# Altium schematic sheet input_module.SchDoc
size A4
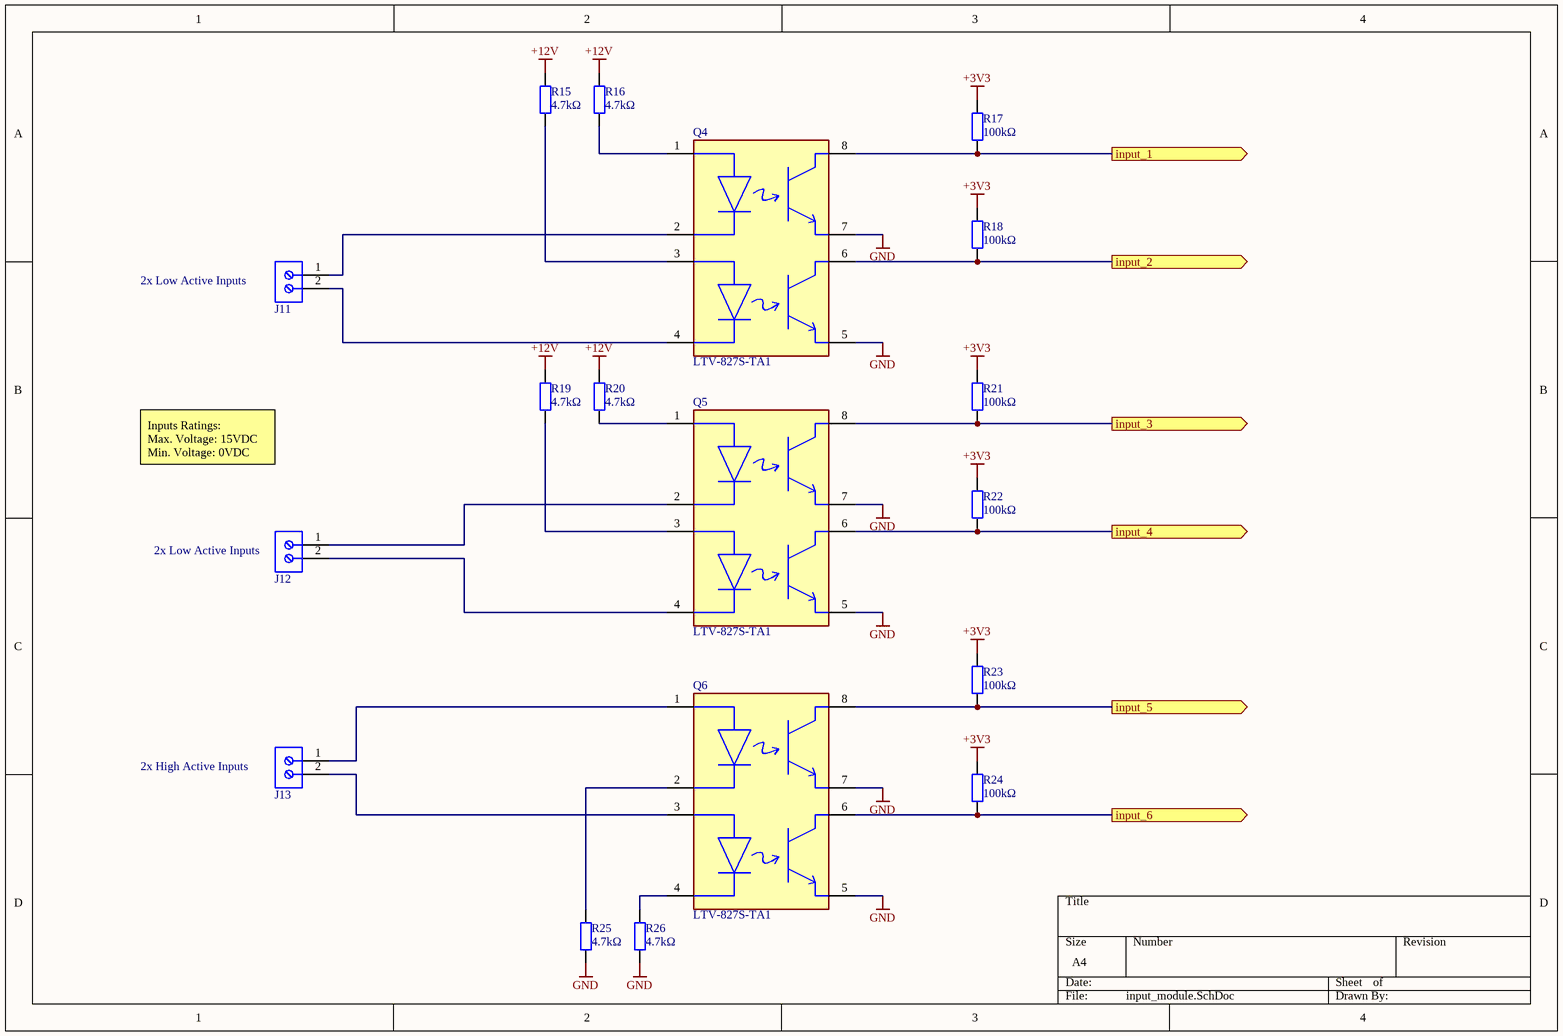
[diagram p0: input_module.SchDoc]

## Parts
J11  282836-2  [TECO-282836-2_V]  (value not drawn)
J12  282836-2  [TECO-282836-2_V]  (value not drawn)
J13  282836-2  [TECO-282836-2_V]  (value not drawn)
Q4  LTV-827S-TA1  [FP-LTV-827S-TA1-MFG]
Q5  LTV-827S-TA1  [FP-LTV-827S-TA1-MFG]
Q6  LTV-827S-TA1  [FP-LTV-827S-TA1-MFG]
R15  4.7kΩ  [RESC2013X50X30ML20T20]
R16  4.7kΩ  [RESC2013X50X30ML20T20]
R17  100kΩ  [RESC2013X50X30ML20T20]
R18  100kΩ  [RESC2013X50X30ML20T20]
R19  4.7kΩ  [RESC2013X50X30ML20T20]
R20  4.7kΩ  [RESC2013X50X30ML20T20]
R21  100kΩ  [RESC2013X50X30ML20T20]
R22  100kΩ  [RESC2013X50X30ML20T20]
R23  100kΩ  [RESC2013X50X30ML20T20]
R24  100kΩ  [RESC2013X50X30ML20T20]
R25  4.7kΩ  [RESC2013X50X30ML20T20]
R26  4.7kΩ  [RESC2013X50X30ML20T20]

## Ports
input_1 (out), input_2 (out), input_3 (out), input_4 (out), input_5 (out), input_6 (out)

## Nets
+3V3: R17.1 R18.1 R21.1 R22.1 R23.1 R24.1
+12V: R15.1 R16.1 R19.1 R20.1
GND: Q4.5(E) Q4.7(E) Q5.5(E) Q5.7(E) Q6.5(E) Q6.7(E) R25.2 R26.2
input_1: Q4.8(C) R17.2 ; port input_1
input_2: Q4.6(C) R18.2 ; port input_2
input_3: Q5.8(C) R21.2 ; port input_3
input_4: Q5.6(C) R22.2 ; port input_4
input_5: Q6.8(C) R23.2 ; port input_5
input_6: Q6.6(C) R24.2 ; port input_6
NetJ11_1: J11.1 Q4.2(1_Cathode)
NetJ11_2: J11.2 Q4.4(2_Cathode)
NetJ12_1: J12.1 Q5.2(1_Cathode)
NetJ12_2: J12.2 Q5.4(2_Cathode)
NetJ13_1: J13.1 Q6.1(1_Anode)
NetJ13_2: J13.2 Q6.3(2_Anode)
NetQ4_1: Q4.1(1_Anode) R16.2
NetQ4_3: Q4.3(2_Anode) R15.2
NetQ5_1: Q5.1(1_Anode) R20.2
NetQ5_3: Q5.3(2_Anode) R19.2
NetQ6_2: Q6.2(1_Cathode) R25.1
NetQ6_4: Q6.4(2_Cathode) R26.1

## Notes on the sheet
- (near J11) 2x Low Active Inputs
- Inputs Ratings:
  Max. Voltage: 15VDC
  Min. Voltage: 0VDC
- (near J12) 2x Low Active Inputs
- (near J13) 2x High Active Inputs

## Library data of the parts
J11-J13 = CMP-1684-00017-1: Female Header, Pitch 5 mm, 1 x 2 Position, Height 10 mm, Tail Length 3.5 mm, Rohs, Bulk; Manufacturer: TE Connectivity; Wire Gauge: 16-30AWG; Product Training Modules: Wire-to-BoardEurostyleTerminalBlocks; Clamp Material - Plating: Brass-NickelPlated; Voltage: 300V; Mating Orientation: HorizontalwithBoard; Current: 13.5A; Pitch: 0.197"(5.00mm); Screw Thread: M3; 3D Model: 282836-2.pdf; Other Names: 5ULV-02B / A98076; Dynamic Catalog: BuchananSeries; Number of Levels: 1; Torque - Screw: 0.68Nm(6Lb-In); Featured Product: EurostyleTerminalBlockConnectors; Positions Per Level: 2; Wire Termination: Screw-RisingCageClamp; Datasheet URL: http://www.te.com.cn/commerce/DocumentDelivery/DDEController?Action=showdoc&DocId=Catalog+Section%7F1308389_EUROSTYLE_TERMINAL_BLOCKS%7F0607%7Fpdf%7FEnglish%7FENG_CS_1308389_EUROSTYLE_TERMINAL_BLOCKS_0607.pdf%7F282836-2; Color: Green; Family: TerminalBlocks-WiretoBoard; RoHS Information: 282836-2StatementofCompliance; Standard Package: 300; Contact Material - Plating: Brass-TinPlated; Manufacturer URL: http://www.te.com; Housing Material: Polyamide(PA66),Nylon6/6; Features: Interlocking(Side); Package Description: Female Header, Pitch 5 mm, 1 x 2 Position, Height 10 mm, Tail Length 3.5 mm; Mounting Type: ThroughHole; Package Reference: THD; Packaging: Bulk; Series: Buchanan; Category: Connectors,Interconnects; Screw Material - Plating: Brass-NickelPlated
Q4-Q6 = CMP-22018-000005-1: OPTOISOLATOR 5KV 2CH TRANS 8-SMD; Number of Channels: 2; Forward Current: 50mA; Reverse Breakdown Voltage: 6V; Current Transfer Ratio: 600%; Collector Emitter Saturation Voltage: 200mV; Collector Emitter Voltage (VCEO): 35V; Max Power Dissipation: 200mW; Rise Time: 18000ns; Forward Voltage: 1.4V; Number of Elements: 2; Min Operating Temperature: -30°C; Number of Circuits: 2; Max Collector Current: 50mA; Packaging: Tape and Reel; Max Input Current: 50mA; Case/Package: SMD/SMT; Radiation Hardening: No; Package Quantity: 1000; Max Output Voltage: 35V; Output Current per Channel: 50mA; Fall Time: 18000ns; Mount: Surface Mount; Isolation Voltage: 5kV; Power Dissipation: 200mW; Lead Free: Lead Free; Max Operating Temperature: 110°C; Output Voltage: 35V; Number of Pins: 8
R15-R26 = Res_0805: Resistor